# Altium project LimeSDR-QPCIe_1v2.PrjPcb (part 9 of 13)

## Sheet 24_Peripherals.SchDoc: Peripherals
size A3; Organization: Lime Microsystems; Address1: Surrey Tech Centre; Address2: Guildford GU2 7YG; Address3: Surrey; Address4: United Kingdom; Revision: v1.2; SheetNumber: 22; SheetTotal: 27
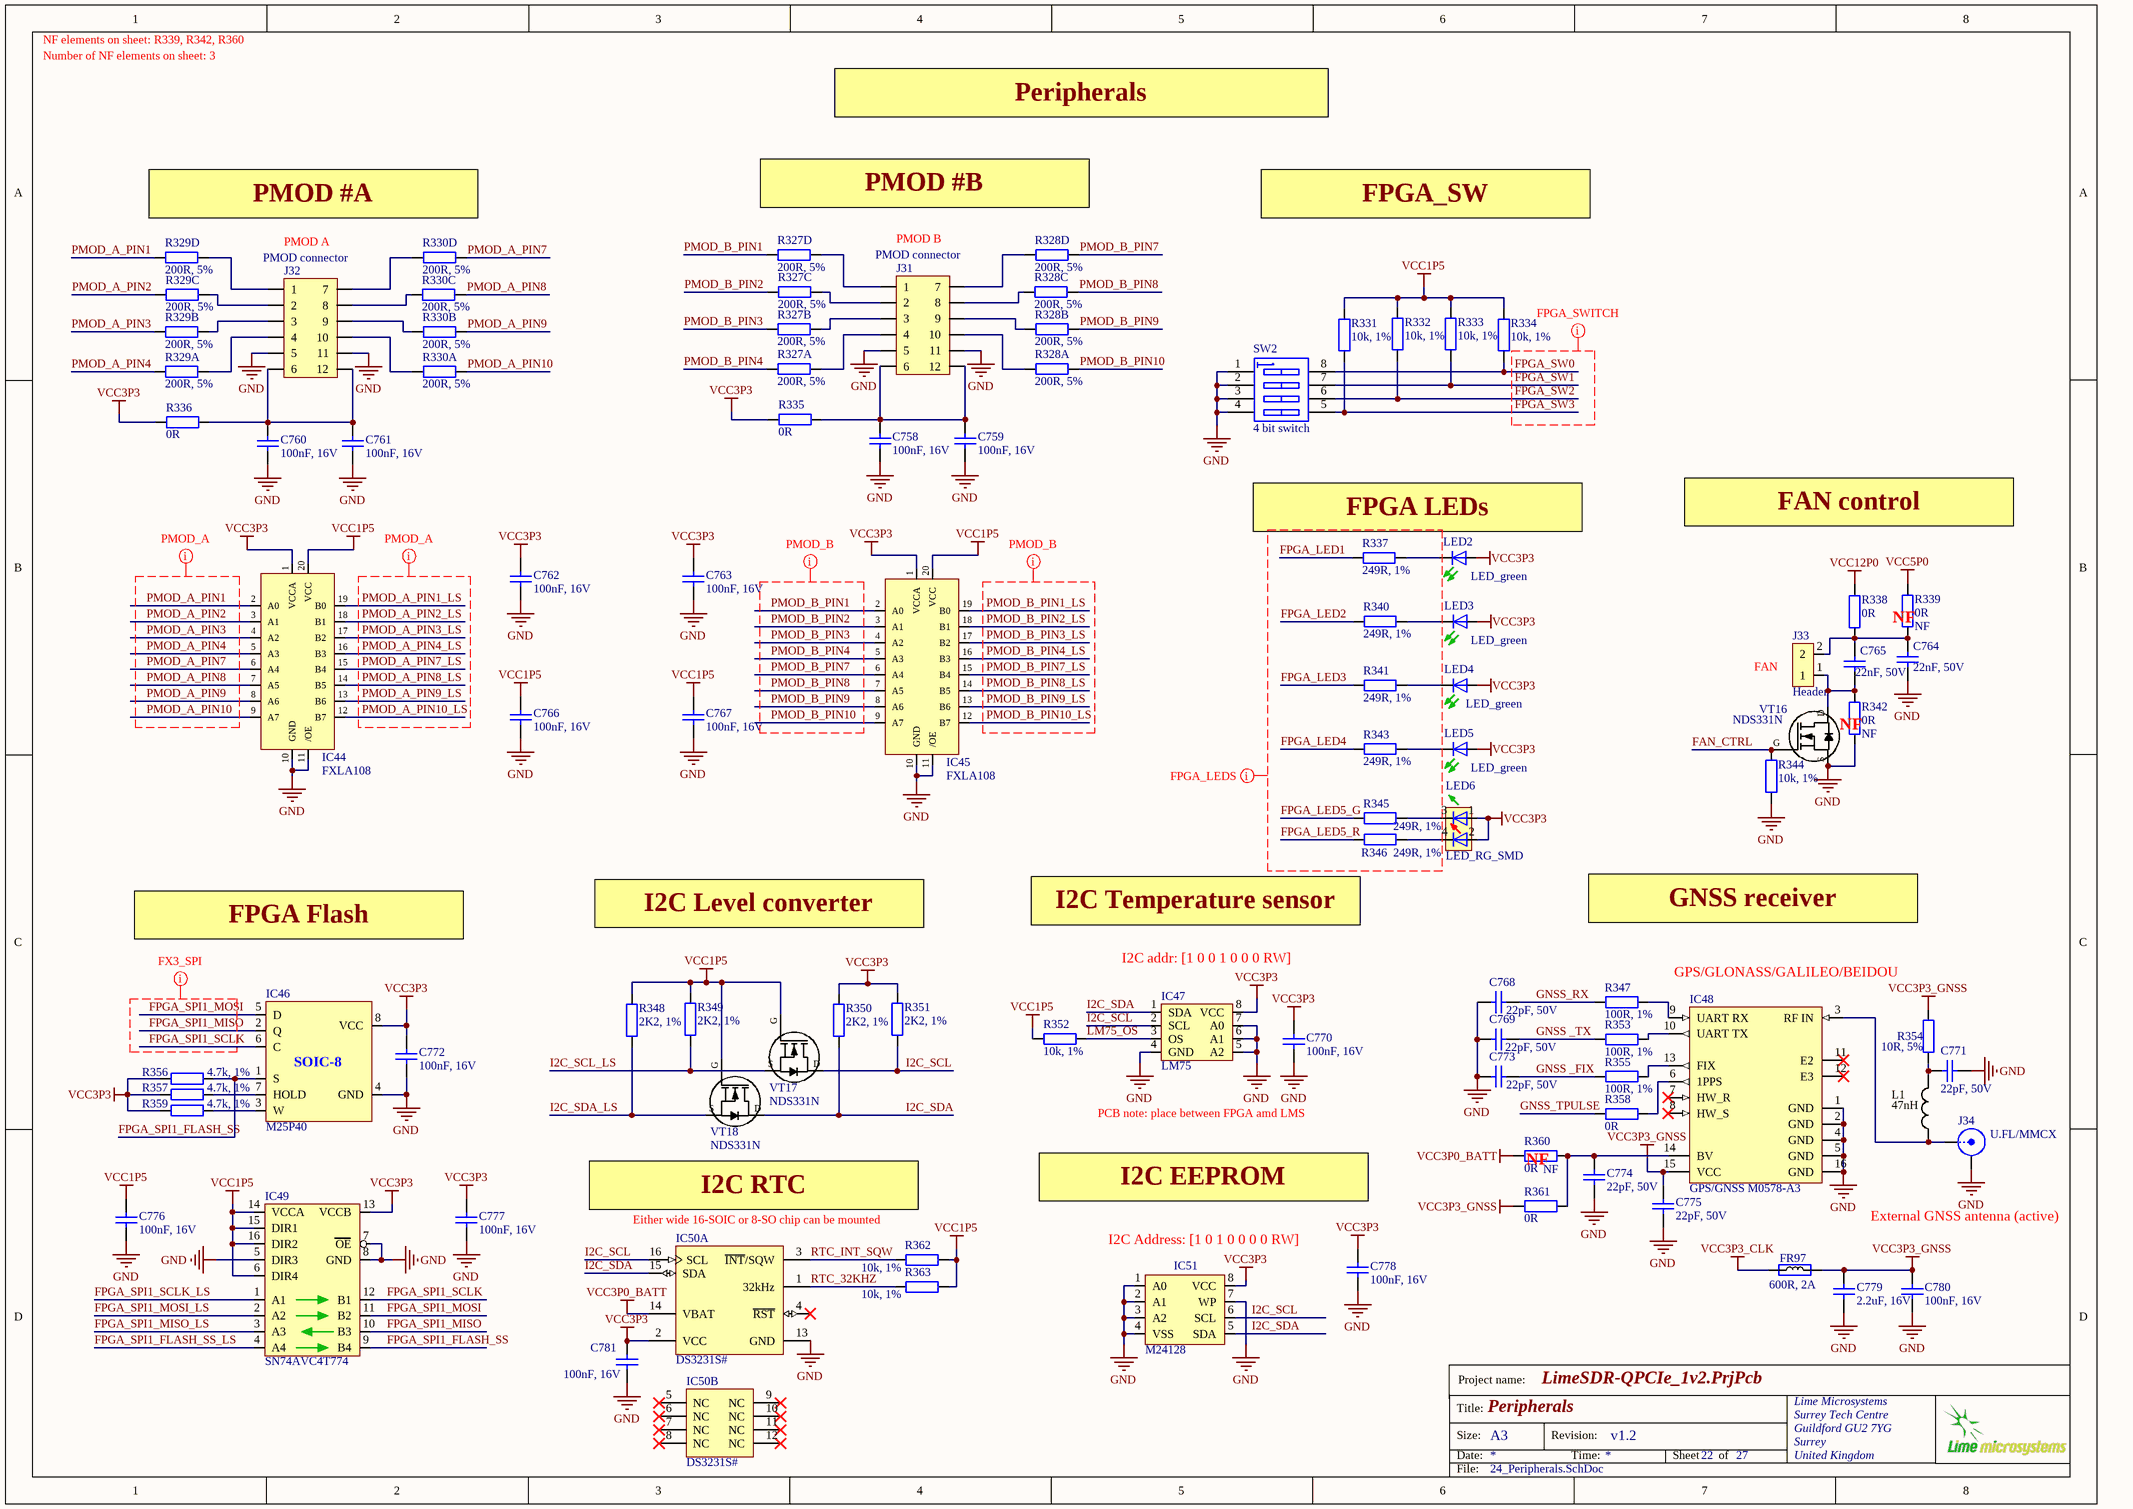
[diagram p23: 24_Peripherals.SchDoc]

### Parts
C758  100nF, 16V  [CAP0402]
C759  100nF, 16V  [CAP0402]
C760  100nF, 16V  [CAP0402]
C761  100nF, 16V  [CAP0402]
C762  100nF, 16V  [CAP0402]
C763  100nF, 16V  [CAP0402]
C764  22nF, 50V  [CAP0402]
C765  22nF, 50V  [CAP0402]
C766  100nF, 16V  [CAP0402]
C767  100nF, 16V  [CAP0402]
C768  22pF, 50V  [CAP0402]
C769  22pF, 50V  [CAP0402]
C770  100nF, 16V  [CAP0402]
C771  22pF, 50V  [CAP0402]
C772  100nF, 16V  [CAP0402]
C773  22pF, 50V  [CAP0402]
C774  22pF, 50V  [CAP0402]
C775  22pF, 50V  [CAP0402]
C776  100nF, 16V  [CAP0402]
C777  100nF, 16V  [CAP0402]
C778  100nF, 16V  [CAP0402]
C779  2.2uF, 16V  [CAP0402]
C780  100nF, 16V  [CAP0402]
C781  100nF, 16V  [CAP0402]
FR97  600R, 2A  [RES0805]
IC44  FXLA108  [FXLA108]
IC45  FXLA108  [FXLA108]
IC46  M25P40  [M25P40-VMN6TPB_SO8N]
IC47  LM75  [HWSON8_LM75]
IC48  GPS/GNSS M0578-A3  [M10578-A3]
IC49  SN74AVC4T774  [SN74AVC4T774]
IC50  DS3231S#  [DS3231S#_SOIC16_SOIC8]  (parts A,B of 2)
IC51  M24128  [24FC512]
J31  PMOD connector  [PMODconn_right_angle_TH]
J32  PMOD connector  [PMODconn_right_angle_TH]
J33  Header  [HDR_1x2]
J34  U.FL/MMCX  [MMCX_UFL_conn_u]
L1  47nH  [RES0402]
LED2  LED_green  [LED-0603-GREEN]
LED3  LED_green  [LED-0603-GREEN]
LED4  LED_green  [LED-0603-GREEN]
LED5  LED_green  [LED-0603-GREEN]
LED6  LED_RG_SMD  [LED-2x0603]
R327  200R, 5%  [ChipResistorArray]  (parts A,B,C,D of 4)
R328  200R, 5%  [ChipResistorArray]  (parts A,B,C,D of 4)
R329  200R, 5%  [ChipResistorArray]  (parts A,B,C,D of 4)
R330  200R, 5%  [ChipResistorArray]  (parts A,B,C,D of 4)
R331  10k, 1%  [RES0402]
R332  10k, 1%  [RES0402]
R333  10k, 1%  [RES0402]
R334  10k, 1%  [RES0402]
R335  0R  [RES0402]
R336  0R  [RES0402]
R337  249R, 1%  [RES0402]
R338  0R  [RES0402]
R339  0R  Assembly Info: NF  [RES0402]
R340  249R, 1%  [RES0402]
R341  249R, 1%  [RES0402]
R342  0R  Assembly Info: NF  [RES0402]
R343  249R, 1%  [RES0402]
R344  10k, 1%  [RES0402]
R345  249R, 1%  [RES0402]
R346  249R, 1%  [RES0402]
R347  100R, 1%  [RES0402]
R348  2K2, 1%  [RES0402]
R349  2K2, 1%  [RES0402]
R350  2K2, 1%  [RES0402]
R351  2K2, 1%  [RES0402]
R352  10k, 1%  [RES0402]
R353  100R, 1%  [RES0402]
R354  10R, 5%  [RES0402]
R355  100R, 1%  [RES0402]
R356  4.7k, 1%  [RES0402]
R357  4.7k, 1%  [RES0402]
R358  0R  [RES0402]
R359  4.7k, 1%  [RES0402]
R360  0R  Assembly Info: NF  [RES0402_v2]
R361  0R  [RES0402]
R362  10k, 1%  [RES0402]
R363  10k, 1%  [RES0402]
SW2  4 bit switch  [SW_4WAY_SMD_1P27]
VT16  NDS331N  [SOT23-3]
VT17  NDS331N  [SOT23-3]
VT18  NDS331N  [SOT23-3]

### Nets
GND: C758.2 C759.2 C760.2 C761.2 C762.2 C763.2 C764.2 C766.2 C767.2 C768.2 C769.2 C770.2 C771.1 C772.2 C773.2 C774.1 C775.1 C776.2 C777.2 C778.2 C779.1 C780.1 C781.2 IC44.10(GND) IC44.11(/OE) IC45.10(GND) IC45.11(/OE) IC46.4(GND) IC47.4(GND) IC47.5(A2) IC47.6(A1) IC47.7(A0) IC48.1(GND) IC48.2(GND) IC48.4(GND) IC48.5(GND) IC48.16(GND) IC49.5(DIR3) IC49.7(OE) IC49.8(GND) IC50.13(GND) IC51.1(A0) IC51.2(A1) IC51.3(A2) IC51.4(VSS) IC51.7(WP) J31.5 J31.11 J32.5 J32.11 J34.2(Y) R342.1 R344.2 SW2.1(A1) SW2.2(A2) SW2.3(A3) SW2.4(A4) VT16.S
VCC1P5: C766.1 C767.1 C776.1 IC44.20(VCC) IC45.20(VCC) IC49.6(DIR4) IC49.14(VCCA) IC49.15(DIR1) IC49.16(DIR2) R331.1 R332.1 R333.1 R334.1 R348.1 R349.1 R352.2 R362.2 R363.2 VT17.G VT18.G
VCC3P0_BATT: IC50.14(VBAT) R360.2
VCC3P3: C762.1 C763.1 C770.1 C772.1 C777.1 C778.1 C781.1 IC44.1(VCCA) IC45.1(VCCA) IC46.8(VCC) IC47.8(VCC) IC49.13(VCCB) IC50.2(VCC) IC51.8(VCC) LED2.A LED3.A LED4.A LED5.A LED6.1 LED6.2 R335.2 R336.2 R350.1 R351.1 R356.2 R357.2 R359.2
VCC3P3_CLK: FR97.1
VCC3P3_GNSS: C775.2 C779.2 C780.2 FR97.2 IC48.15(VCC) R354.1 R361.2
VCC5P0: R339.2
VCC12P0: R338.2
FAN_CTRL: R344.1 VT16.G
FPGA_LED1: R337.1
FPGA_LED2: R340.1
FPGA_LED3: R341.1
FPGA_LED4: R343.1
FPGA_LED5_G: R345.1
FPGA_LED5_R: R346.1
FPGA_SPI1_FLASH_SS: IC46.1(S) IC49.9(B4) R356.1
FPGA_SPI1_FLASH_SS_LS: IC49.4(A4)
FPGA_SPI1_MISO: IC46.2(Q) IC49.10(B3)
FPGA_SPI1_MISO_LS: IC49.3(A3)
FPGA_SPI1_MOSI: IC46.5(D) IC49.11(B2)
FPGA_SPI1_MOSI_LS: IC49.2(A2)
FPGA_SPI1_SCLK: IC46.6(C) IC49.12(B1)
FPGA_SPI1_SCLK_LS: IC49.1(A1)
FPGA_SW0: R334.2 SW2.8(B1)
FPGA_SW1: R333.2 SW2.7(B2)
FPGA_SW2: R332.2 SW2.6(B3)
FPGA_SW3: R331.2 SW2.5(B4)
GNSS _FIX: C773.1 R355.2
GNSS _TX: C769.1 R353.2
GNSS_RX: C768.1 R347.2
GNSS_TPULSE: R358.2
I2C_SCL: IC47.2(SCL) IC50.16(SCL) IC51.6(SCL) R351.2 VT17.D
I2C_SCL_LS: R349.2 VT17.S
I2C_SDA: IC47.1(SDA) IC50.15(SDA) IC51.5(SDA) R350.2 VT18.D
I2C_SDA_LS: R348.2 VT18.S
LM75_OS: IC47.3(OS) R352.1
PMOD_A_PIN1: IC44.2(A0) R329.7
PMOD_A_PIN1_LS: IC44.19(B0)
PMOD_A_PIN2: IC44.3(A1) R329.5
PMOD_A_PIN2_LS: IC44.18(B1)
PMOD_A_PIN3: IC44.4(A2) R329.3
PMOD_A_PIN3_LS: IC44.17(B2)
PMOD_A_PIN4: IC44.5(A3) R329.1
PMOD_A_PIN4_LS: IC44.16(B3)
PMOD_A_PIN7: IC44.6(A4) R330.7
PMOD_A_PIN7_LS: IC44.15(B4)
PMOD_A_PIN8: IC44.7(A5) R330.5
PMOD_A_PIN8_LS: IC44.14(B5)
PMOD_A_PIN9: IC44.8(A6) R330.3
PMOD_A_PIN9_LS: IC44.13(B6)
PMOD_A_PIN10: IC44.9(A7) R330.1
PMOD_A_PIN10_LS: IC44.12(B7)
PMOD_B_PIN1: IC45.2(A0) R327.7
PMOD_B_PIN1_LS: IC45.19(B0)
PMOD_B_PIN2: IC45.3(A1) R327.5
PMOD_B_PIN2_LS: IC45.18(B1)
PMOD_B_PIN3: IC45.4(A2) R327.3
PMOD_B_PIN3_LS: IC45.17(B2)
PMOD_B_PIN4: IC45.5(A3) R327.1
PMOD_B_PIN4_LS: IC45.16(B3)
PMOD_B_PIN7: IC45.6(A4) R328.7
PMOD_B_PIN7_LS: IC45.15(B4)
PMOD_B_PIN8: IC45.7(A5) R328.5
PMOD_B_PIN8_LS: IC45.14(B5)
PMOD_B_PIN9: IC45.8(A6) R328.3
PMOD_B_PIN9_LS: IC45.13(B6)
PMOD_B_PIN10: IC45.9(A7) R328.1
PMOD_B_PIN10_LS: IC45.12(B7)
RTC_32KHZ: IC50.1(32kHz) R363.1
RTC_INT_SQW: IC50.3(~{INT}/SQW) R362.1
NetC758_1: C758.1 C759.1 J31.6 J31.12 R335.1
NetC760_1: C760.1 C761.1 J32.6 J32.12 R336.1
NetC764_1: C764.1 C765.1 J33.2 R338.1 R339.1
NetC765_2: C765.2 J33.1 R342.2 VT16.D
NetC771_2: C771.2 L1.2 R354.2
NetC774_2: C774.2 IC48.14(BV) R360.1 R361.1
NetIC46_3: IC46.3(W) R359.1
NetIC46_7: IC46.7(HOLD) R357.1
NetIC48_3: IC48.3(RF_IN) J34.1(X) L1.1
NetIC48_6: IC48.6(1PPS) R358.1
NetIC48_9: IC48.9(UART_RX) R347.1
NetIC48_10: IC48.10(UART_TX) R353.1
NetIC48_13: IC48.13(FIX) R355.1
NetJ31_1: J31.1 R327.8
NetJ31_2: J31.2 R327.6
NetJ31_3: J31.3 R327.4
NetJ31_4: J31.4 R327.2
NetJ31_7: J31.7 R328.8
NetJ31_8: J31.8 R328.6
NetJ31_9: J31.9 R328.4
NetJ31_10: J31.10 R328.2
NetJ32_1: J32.1 R329.8
NetJ32_2: J32.2 R329.6
NetJ32_3: J32.3 R329.4
NetJ32_4: J32.4 R329.2
NetJ32_7: J32.7 R330.8
NetJ32_8: J32.8 R330.6
NetJ32_9: J32.9 R330.4
NetJ32_10: J32.10 R330.2
NetLED2_K: LED2.K(C) R337.2
NetLED3_K: LED3.K(C) R340.2
NetLED4_K: LED4.K(C) R341.2
NetLED5_K: LED5.K(C) R343.2
NetLED6_3: LED6.3 R345.2
NetLED6_4: LED6.4 R346.2

Not connected (* = marked no-connect by the designer): IC48 7(HW_R)* 8(HW_S)* 11(E2)* 12(E3)*; IC50 4(~{RST})* 5(NC)* 6(NC)* 7(NC)* 8(NC)* 9(NC)* 10(NC)* 11(NC)* 12(NC)*

### Layout directives
net class FX3_SPI: FPGA_SPI1_MISO, FPGA_SPI1_MOSI, FPGA_SPI1_SCLK
net class PMOD_A: PMOD_A_PIN1, PMOD_A_PIN1_LS, PMOD_A_PIN2, PMOD_A_PIN2_LS, PMOD_A_PIN3, PMOD_A_PIN3_LS, PMOD_A_PIN4, PMOD_A_PIN4_LS, PMOD_A_PIN7, PMOD_A_PIN7_LS, PMOD_A_PIN8, PMOD_A_PIN8_LS, PMOD_A_PIN9, PMOD_A_PIN9_LS, PMOD_A_PIN10, PMOD_A_PIN10_LS
net class PMOD_B: PMOD_B_PIN1, PMOD_B_PIN1_LS, PMOD_B_PIN2, PMOD_B_PIN2_LS, PMOD_B_PIN3, PMOD_B_PIN3_LS, PMOD_B_PIN4, PMOD_B_PIN4_LS, PMOD_B_PIN7, PMOD_B_PIN7_LS, PMOD_B_PIN8, PMOD_B_PIN8_LS, PMOD_B_PIN9, PMOD_B_PIN9_LS, PMOD_B_PIN10, PMOD_B_PIN10_LS
net class FPGA_SWITCH: FPGA_SW0, FPGA_SW1, FPGA_SW2, FPGA_SW3
net class FPGA_LEDS: FPGA_LED1, FPGA_LED2, FPGA_LED3, FPGA_LED4, FPGA_LED5_G, FPGA_LED5_R

### Notes on the sheet
- NF elements on sheet: R339, R342, R360
- Number of NF elements on sheet: 3
- Peripherals
- PMOD #A
- (near J32) PMOD A
- PMOD #B
- (near J31) PMOD B
- FPGA_SW
- FPGA LEDs
- FAN control
- (near R339) NF
- FAN
- NF
- I2C Level converter
- I2C Temperature sensor
- GNSS receiver
- FPGA Flash
- I2C addr: [1 0 0 1 0 0 0 RW]
- GPS/GLONASS/GALILEO/BEIDOU
- PCB note: place between FPGA amd LMS
- (near R360) NF
- I2C RTC
- Either wide 16-SOIC or 8-SO chip can be mounted
- I2C EEPROM
- I2C Address: [1 0 1 0 0 0 0 RW]
- External GNSS antenna (active)
- Project name:
- Title:
- Size:
- Date:
- A3
- Revision:
- Time:
- Sheet
- of
- File:
- (in symbol M25P40) SOIC-8

### Library data of the parts
C758-C761 C770 = Cap_0603: Manufacturer Part Number 1: GRM155R71C104KA88D; Part Description: 0.10µF ±10% 16V Ceramic Capacitor X7R 0402 (1005 Metric); Brand: Murata Electronics; Tolerance: 10 %; Type: General Purpose MLCC; Capacitance: 0.1 uF; Temperature Coefficient / Code: +/- 15 %; Case Height: 0.5 mm; Case Length: 1 mm; Dielectric: X7R; Supplier 1: Mouser; Supplier Part Number 1: 81-GRM155R71C104KA88; Case Code - in: 0402; Manufacturer: Murata Electronics; Category: Multilayer Ceramic Capacitors MLCC - SMD/SMT; Voltage Rating DC: 16 V; Value: 100nF, 16V; Manufacturer Part Number: GRM155R71C104KA88D; Case Code - mm: 1005; Case Width: 0.5 mm; Maximum Operating Temperature: + 125 C; Minimum Operating Temperature: - 55 C; Minimum Order Quantity: 1; Operating Temperature Range: - 55 C to + 125 C; Package / Case: 0402 (1005 metric); Packaging: Reel; Product: General Type MLCCs; Product Category: Low & Medium Capacitance SMD Ceramic Chip Capacitors; Reeling: True; RoHS - Mouser: Y; RoHS: RoHS Compliant; Series: GRM; Standard Pack Qty: 10000; Termination Style: SMD/SMT
C762 C763 C766 C767 C772 C776 C777 = Cap_0603: Part Description: 0.10µF ±10% 16V Ceramic Capacitor X7R 0402 (1005 Metric); Manufacturer Part Number 1: GRM155R71C104KA88D; Brand: Murata Electronics; Tolerance: 10 %; Type: General Purpose MLCC; Capacitance: 0.1 uF; Temperature Coefficient / Code: +/- 15 %; Case Height: 0.5 mm; Case Length: 1 mm; Dielectric: X7R; Supplier 1: Mouser; Supplier Part Number 1: 81-GRM155R71C104KA88; Case Code - in: 0402; Manufacturer: Murata Electronics; Category: Multilayer Ceramic Capacitors MLCC - SMD/SMT; Voltage Rating DC: 16 V; Value: 100nF, 16V; Case Code - mm: 1005; Case Width: 0.5 mm; Manufacturer Part Number: GRM155R71C104KA88D; Maximum Operating Temperature: + 125 C; Minimum Operating Temperature: - 55 C; Minimum Order Quantity: 1; Operating Temperature Range: - 55 C to + 125 C; Package / Case: 0402 (1005 metric); Packaging: Reel; Product: General Type MLCCs; Product Category: Low & Medium Capacitance SMD Ceramic Chip Capacitors; Reeling: True; RoHS - Mouser: Y; RoHS: RoHS Compliant; Series: GRM; Standard Pack Qty: 10000; Termination Style: SMD/SMT
C764 C765 = Cap_0402: Manufacturer: Kemet; Manufacturer Part Number 1: C0402C223K5RACTU; Part Description: 0.022µF ±10% 50V Ceramic Capacitor X7R 0402 (1005 Metric); Temperature Coefficient: X7R; Tolerance: ±10%; Capacitance: 0.022µF; Value: 22nF, 50V; Supplier 1: Digi-Key; Supplier Part Number 1: 399-7780-1-ND; Ratings: -; Packaging: Cut Tape (CT); Category: Capacitors; Size / Dimension: 0.039" L x 0.020" W (1.00mm x 0.50mm); RoHS: RoHS Compliant; Operating Temperature: -55°C ~ 125°C; Mounting Type: Surface Mount, MLCC; Applications: General Purpose; Voltage - Rated: 50V; Thickness (Max): 0.022" (0.55mm); Features: -; Height - Seated (Max): -; Lead Style: -; Package / Case: 0402 (1005 Metric); Lead Spacing: -
C768 C769 C771 C773-C775 = Cap_0402: Manufacturer: Yageo; Manufacturer Part Number 1: CC0402JRNPO9BN220; Part Description: 22pF ±5% 50V Ceramic Capacitor C0G, NP0 0402 (1005 Metric); Tolerance: ±5%; Temperature Coefficient: C0G, NP0; Value: 22pF, 50V; Supplier 1: Digi-Key; Supplier Part Number 1: 311-1018-2-ND; Category: Capacitors; Voltage - Rated: 50V; Packaging: Tape & Reel (TR); RoHS: RoHS Compliant; Capacitance: 22pF; Operating Temperature: -55°C ~ 125°C; Mounting Type: Surface Mount, MLCC; Height - Seated (Max): -; Size / Dimension: 0.039" L x 0.020" W (1.00mm x 0.50mm); Ratings: -; Applications: General Purpose; Thickness (Max): 0.022" (0.55mm); Lead Spacing: -; Lead Style: -; Features: -; Package / Case: 0402 (1005 Metric)
C778 = Cap_0603: Manufacturer Part Number 1: GRM155R71C104KA88D; Part Description: 0.10µF ±10% 16V Ceramic Capacitor X7R 0402 (1005 Metric); Brand: Murata Electronics; Tolerance: 10 %; Type: General Purpose MLCC; Capacitance: 0.1 uF; Temperature Coefficient / Code: +/- 15 %; Supplier 1: Mouser; Supplier Part Number 1: 81-GRM155R71C104KA88; Case Code - in: 0402; Manufacturer: Murata Electronics; Category: Multilayer Ceramic Capacitors MLCC - SMD/SMT; Voltage Rating DC: 16 V; Value: 100nF, 16V; Manufacturer Part Number: GRM155R71C104KA88D
C779 = Cap_0402: CAP CER 2.2UF 16V 10% X5R 0402; Manufacturer Part Number 1: C1005X5R1C225K050BC; Manufacturer: TDK Corporation; Part Description: 2.2µF ±10% 16V Ceramic Capacitor X5R 0402 (1005 Metric); Capacitance: 2.2µF; Tolerance: ±20%; Capacitor Case Style: 0402 [1005 Metric]; Value: 2.2uF, 16V; Supplier 1: Digi-Key; Supplier Part Number 1: 445-9085-6-ND; Category: Capacitors; Voltage - Rated: 16V; Thickness (Max): 0.022" (0.55mm); Applications: General Purpose; Package / Case: 0402 (1005 Metric); Size / Dimension: 0.039" L x 0.020" W (1.00mm x 0.50mm); Features: -; Temperature Coefficient: X5R; Mounting Type: Surface Mount, MLCC; Ratings: -; Lead Style: -; Operating Temperature: -55°C ~ 85°C; Lead Spacing: -; RoHS: RoHS Compliant; Height - Seated (Max): -; Packaging: Tape & Reel (TR); Operating Temperature Range: -55°C to +85
C780 C781 = Cap_0402: Manufacturer: Murata Electronics; Manufacturer Part Number: GRM155R71C104KA88D; Part Description: 0.10µF ±10% 16V Ceramic Capacitor X7R 0402 (1005 Metric); Tolerance: 10 %; Type: General Purpose MLCC; Capacitance: 0.1 uF; Case Length: 1 mm; Dielectric: X7R; Case Height: 0.5 mm; Temperature Coefficient / Code: +/- 15 %; Value: 100nF, 16V; Supplier 1: Mouser; Supplier Part Number 1: 81-GRM155R71C104KA88; Case Code - in: 0402; RoHS: RoHS Compliant; Operating Temperature Range: - 55 C to + 125 C; Series: GRM; Termination Style: SMD/SMT; Package / Case: 0402 (1005 metric); Voltage Rating DC: 16 V; Maximum Operating Temperature: + 125 C; Case Code - mm: 1005; Minimum Operating Temperature: - 55 C; Product Category: Low & Medium Capacitance SMD Ceramic Chip Capacitors; Packaging: Reel; Product: General Type MLCCs; Category: Multilayer Ceramic Capacitors MLCC - SMD/SMT; Brand: Murata Electronics; Case Width: 0.5 mm; RoHS - Mouser: Y; Standard Pack Qty: 10000; Minimum Order Quantity: 1; Reeling: True; Manufacturer Part Number 1: GRM155R71C104KA88D
FR97 = Ferrite: Manufacturer Part Number 1: MPZ2012S601A; Manufacturer: TDK; Part Description: FERRITE BEAD 600 OHM 0805 1LN; Filter Type: Differential Mode - Single; Impedance @ Frequency: 600 Ohm @ 100MHz; DC Resistance (DCR): 100 mOhm Max; DC Current Rating: 2; DC Resistance Max: 0.1; Ferrite Case Style: 0805 [2012 Metric]; Ferrite Mounting: SMD; Impedance @ 100MHz: 600; Impedance Tolerance: ± 25%; Supplier 1: Farnell; Supplier Part Number 1: 1669753RL; Mounting Type: Surface Mount; RoHS: RoHS Compliant; Height (Max): 0.041" (1.05mm); Packaging: Tape & Reel (TR); Category: Filters; Current Rating: 2A; Package / Case: 0805 (2012 Metric); Size / Dimension: 0.079" L x 0.049" W (2.00mm x 1.25mm); Value: 600R, 2A; Core Material: Ferrite; Supplier: Farnell
IC44 IC45 = FXLA108: Manufacturer: Fairchild Semiconductor; Manufacturer Part Number 1: FXLA108BQX; Part Description: Voltage Level Translator Bidirectional 1 Circuit 8 Channel 140Mbps 20-DQFN (2.5x4.5); Logic Function: Translator, Bidirectional, Unidirectional, 3-State; Data Rate: 140Mbps; Voltage - Supply: 1.1 V ~ 3.6 V; Propagation Delay (Max): 4ns; Supplier 1: Digi-Key; Supplier Device Package: 20-DQFN; Category: Integrated Circuits (ICs); Supplier Part Number 1: FXLA108BQXCT-ND
IC46 = M25P40: Manufacturer: Micron Technology Inc; Manufacturer Part Number 1: M25P40-VMN6TPB TR; Part Description: IC FLASH 4MBIT 75MHZ 8SO; Memory Size: 4M (512K x 8); Voltage - Supply: 2.3 V ~ 3.6 V; Supplier 1: Digi-Key; Supplier Device Package: 8-SO; Supplier: Digi-Key; Supplier Part Number 1: M25P40-VMN6TPBTR-ND
IC47 = LM75: Manufacturer: NXP Semiconductors; Manufacturer Part Number: LM75BTP,147; Part Description: Temperature Sensor Digital, Local -55°C ~ 125°C 11 b 8-HWSON (2x3); Sensing Temperature - Local: -55°C ~ 125°C; Output Type: I²C; Accuracy - Highest (Lowest): ±2°C (±3°C); Voltage - Supply: 2.8 V ~ 5.5 V; Test Condition: -25°C ~ 100°C (-55°C ~ 125°C); Sensor Type: Digital, Local; Resolution: 10 b; Supplier 1: Digi-Key; Operating Temperature: -55°C ~ 125°C; Features: Output Switch, Programmable Limit, Shutdown Mode; Supplier Device Package: 8-HWSON (2x3); Sensing Temperature - Remote: -; Category: Sensors, Transducers; Packaging: Tape & Reel (TR); RoHS: RoHS Compliant; Package / Case: 8-WFDFN Exposed Pad; Supplier Part Number 1: 568-9815-2-ND
IC48 = M10578-A3_GPS_GNSS: Manufacturer: Antenova; Part Description: RADIONOVA RF Receiver GPS 1.575GHz -165dBm Module; Frequency: 1.575GHz; Sensitivity: -165dBm; Modulation or Protocol: GPS; Current - Receiving: 28mA; Data Interface: UART; Voltage - Supply: 3.3V; Supplier 1: Digi-Key; Manufacturer Part Number 1: M10578-A3; RoHS: RoHS Compliant; Category: RF/IF and RFID; Stock 1: 0; Pricing 1: 1=17.75, 10=16.061, 25=14.7928, 100=13.5248, 250=12.67952, 500=11.8342 (USD); Packaging: Cut Tape (CT); Part Status: Active; Data Rate (Max): -; Applications: General Purpose; Memory Size: -; Antenna Connector: -; Features: -; Operating Temperature: -40°C ~ 85°C; Package / Case: Module; Supplier Device Package: Module; ComponentLink1URL: http://www.antenova-m2m.com/wp-content/uploads/2015/12/GPS_Radionova_M10578-A3-PS-1.0.pdf; ComponentLink1Description: http://www.antenova-m2m.com/wp-content/uploads/2015/12/GPS_Radionova_M10578-A3-PS-1.0.pdf; Supplier Part Number 1: 627-1074-1-ND
IC49 = SN74AVC4T774: Manufacturer: Texas Instruments; Manufacturer Part Number 1: SN74AVC4T774RSVR; Part Description: Voltage Level Translator Bidirectional 1 Circuit 4 Channel 380Mbps 16-UQFN (2.6x1.8); Logic Function: Translator, Bidirectional, 3-State; Differential - Input:Output: No/No; Propagation Delay (Max): 2.4ns; Number of Bits: 4; Number of Outputs/Channel: 1; Input Type: Logic; Voltage - Supply: 1.2 V ~ 3.6 V; Data Rate: 380Mbps; Supplier 1: Digi-Key; Supplier Device Package: 16-UQFN (2.6x1.8); Packaging: Digi-Reel®; Category: Integrated Circuits (ICs); Mounting Type: Surface Mount; RoHS: RoHS Compliant; Number of Channels: 4; Output Type: Logic; Package / Case: 16-UFQFN; Operating Temperature: -40°C ~ 85°C; Supplier Part Number 1: 296-24741-6-ND
IC50 = DS3231S#: Extremely Accurate I2C-Integrated Real-Time Clock/TCXO/Crystal, 16-Pin SO, 0 to 70 degC, RoHS Qualified; Manufacturer: MAXIM INTEGRATED PRODUCTS; Part Description: Real Time Clock (RTC) IC Clock/Calendar I²C, 2-Wire Serial 16-SOIC (0.295", 7.50mm Width); Date Format: YY-MM-DD; Clock Format: HH; Clock IC Type: RTC; Supply Voltage Min: 2.3; Supply Voltage Max: 5.5; Clock IC Case Style: WSOIC; No. of Pins: 16; IC Interface Type: I2; Supply Voltage Range: 2.3V to 5.5V<!--FANDB--><div class="features-and-benefits-container"><div class="features-and-benefits-description"><span class="features-benefits-value">The DS3231S# is an extremely accurate I²C Real-time Clock (RTC) with an integrated temperature compensated crystal oscillator (TCXO) and crystal. The device incorporates a battery input and maintains accurate timekeeping when main power to the device is interrupted. The integration of the crystal resonator enhances the long-term accuracy of the device as well as reduces the piece-part count in a manufacturing line. The RTC maintains seconds, minutes, hours, day, date, month and year information. The date at the end of the month is automatically adjusted for months with fewer than 31 days, including corrections for leap year. The clock operates in either the 24-hour or 12-hour format with an AM/PM indicator. Two programmable time-of-day alarms and a programmable square-wave output are provided. Address and data are transferred serially through an I²C bidirectional bus.</span></div><div class="features-and-benefits-list"><ul class="features-and-benefits-list-list"><li class="features-and-benefits-list-item">Highly accurate RTC completely manages all timekeeping functions</li><li class="features-and-benefits-list-item">±3; Supplier 1: Farnell; Manufacturer Part Number 1: DS3231S#; RoHS: YES; Pricing 1: 1=6.3, 10=5.75, 25=5.04, 50=4.69, 100=4.33, 250=4.09, 1000=3.84 (GBP); Operating Temperature Min: 0; Operating Temperature Max: 70; Packaging: Each; Product Range: -; Automotive Qualification Standard: -; MSL: MSL 1 - Unlimited; Operating Temperature Range: 0°C to +70; ComponentLink1URL: http://www.farnell.com/datasheets/1904442.pdf; ComponentLink1Description: http://www.farnell.com/datasheets/1904442.pdf; Supplier Part Number 1: 2519295
IC51 = 24FC64F: Part Description: IC EEPROM 128KBIT 1MHZ 8TSSOP; Manufacturer: STMicroelectronics; Manufacturer Part Number 1: M24128-DRDW8TP/K; Format - Memory: EEPROMs - Serial; Memory Type: EEPROM; Memory Size: 128K (16K x 8); Speed: 1MHz; Interface: I²C, 2-Wire Serial; Voltage - Supply: 1.8 V ~ 5.5 V; Supplier 1: Digi-Key; Supplier Part Number 1: 497-15336-1-ND; RoHS: RoHS Compliant; Category: Integrated Circuits (ICs); Stock 1: 1677; Pricing 1: 1=0.47, 10=0.464, 100=0.3805, 500=0.36996, 1000=0.36005 (USD); Packaging: Cut Tape (CT); Part Status: Active; Operating Temperature: -40°C ~ 105°C (TA); Package / Case: 8-TSSOP (0.173", 4.40mm Width); Supplier Device Package: 8-TSSOP; ComponentLink1URL: http://www.st.com/content/ccc/resource/technical/document/datasheet/5c/f3/4b/70/8e/63/48/95/DM00149696.pdf/files/DM00149696.pdf/jcr:content/translations/en.DM00149696.pdf; ComponentLink1Description: http://www.st.com/content/ccc/resource/technical/document/datasheet/5c/f3/4b/70/8e/63/48/95/DM00149696.pdf/files/DM00149696.pdf/jcr:content/translations/en.DM00149696.pdf
J31 J32 = PMOD_connector: Header, 4-Pin, Dual row; Manufacturer: Sullins Connector Solutions; Part Description: 12 Position Header Connector 0.100" (2.54mm) Through Hole, Right Angle Gold; Manufacturer Part Number 1: PPPC062LJBN-RC; Row Spacing: 0.100" (2.54mm); Number of Positions Loaded: All; Number of Positions: 12; Supplier 1: Digi-Key; Mounting Type: Through Hole, Right Angle; Contact Finish: Gold; Features: -; Category: Connectors, Interconnects; Packaging: Bulk; RoHS: RoHS Compliant; Number of Rows: 2; Contact Finish Thickness: Flash; Pitch: 0.100" (2.54mm); Termination: Solder; Contact Type: Female Socket; Color: Black; Connector Type: Header; Fastening Type: -; Supplier Part Number 1: S5559-ND
J33 = Jumper: Manufacturer Part Number 1: 961102-6404-AR; Part Description: 2 Positions Header, Unshrouded Connector 0.100" (2.54mm) Through Hole Gold; Manufacturer: 3M; Connector Type: Header, Unshrouded; Supplier 1: Digi-Key; Supplier Part Number 1: 3M9447-ND; Contact Type: Male Pin; Color: Black; Mounting Type: Through Hole; Category: Connectors, Interconnects; Contact Finish: Gold
J34 = RF_IF_connector: CONN UMC RCPT STR 50 OHM SMD; Manufacturer: Molex, LLC; Manufacturer Part Number 1: 0734120110; Part Description: Ultra Miniature Coaxial Connector Receptacle, Male Pin 50 Ohm Surface Mount Solder; Body Finish: Nickel; Body Material: Phosphor Bronze; Center Contact Material: Brass; Center Contact Plating: Gold; Connector Style: Ultra Miniature Coaxial; Connector Type: Jack, Male Pin; Contact Termination: Solder; Dielectric Material: Liquid Crystal Polymer (LCP); Frequency - Max: 6GHz; Impedance: 50 Ohm; Voltage Rating: 60V; Cable Group: -; Category: Connectors, Interconnects; Fastening Type: Snap-On; Features: -; Housing Color: Silver; Ingress Protection: -; Mounting Type: Surface Mount; Operating Temperature: -40°C ~ 90°C; Packaging: Cut Tape (CT); RoHS: RoHS Compliant; Shield Termination: Solder; Supplier 1: Digi-Key; Supplier Part Number 1: WM5587CT-ND
L1 = Inductor_0603: Manufacturer: COILCRAFT; Manufacturer Part Number: 0402HP-47NXJLU; Part Description: COILCRAFT  0402HP-47NXJLU  Surface Mount High Frequency Inductor, 0402HP Series, 47 nH, 420 mA, 0402 [1005 Metric], Wirewound; SVHC: No SVHC (15-Jun-2015); Inductance Tolerance: ± 5%; High Frequency Inductor Case: 0402 [1005 Metric]; Inductor Case Style: 0402 [1005 Metric]<!--FANDB--><div class="features-and-benefits-container"></div>; Inductance: 47; DC Resistance Max: 0.58; Self Resonant Frequency Min: 2.4; Product Range: 0402; DC Current Rating: 420; Inductor Construction: Wirewound; Supplier 1: Farnell; Supplier Part Number 1: 2285856; Packaging: Cut Tape; RoHS: Y-EX; value: 47nH; Manufacturer Part Number 1: 0402HP-47NXJLU
LED2-LED5 = LED_green: Manufacturer Part Number 1: HSMG-C190; Manufacturer: Avago Technologies US Inc.; Part Description: Green 572nm LED Indication - Discrete 2.2V 0603 (1608 Metric); Manufacturer: Broadcom Limited; Color: Green; Wavelength - Peak: 570nm; Viewing Angle: 170°; Lens Type: Diffused; Lens Style/Size: Rectangle with Flat Top, 1mm x 0.8mm; Voltage - Forward (Vf) (Typ): 2.2V; Millicandela Rating: 15mcd; Current - Test: 20mA; Wavelength - Dominant: 572nm; Supplier 1: Digi-Key; Supplier Part Number 1: 516-1425-2-ND; Height: 0.80mm; Size / Dimension: 1.60mm L x 0.80mm W; Mounting Type: Surface Mount; Category: Optoelectronics; RoHS: RoHS Compliant; Luminous Flux @ Current - Test: -; Package / Case: 0603 (1608 Metric); Packaging: Tape & Reel (TR)
LED6 = LED_green_red_SMD: Manufacturer Part Number 1: HSMF-C165; Manufacturer: Avago Technologies US Inc.; Part Description: LED GREEN/RED DIFFUSED 0603 SMD; Millicandela Rating: 15mcd Green, 10mcd Red; Lens Transparency: Diffused; Lens Color: White; Lens Style/Size: Rectangle with Flat Top, 1.60mm x 0.80mm; Wavelength - Peak: 570nm Green, 636nm Red; Wavelength - Dominant: 572nm Green, 621nm Red; Viewing Angle: 120°; Voltage - Forward (Vf) (Typ): 2.2V Green, 1.95V Red; Current - Test: 20mA; Color: Green, Red; Supplier 1: Digi-Key; Height (Max): 0.50mm; Packaging: Cut Tape (CT); Category: Optoelectronics; Mounting Type: Surface Mount; Package / Case: 0603 (1608 Metric); Size / Dimension: 1.60mm L x 0.80mm W; Supplier Device Package: *; RoHS: RoHS Compliant; Supplier Part Number 1: 516-1419-1-ND
R327-R330 = ResArray_0802: Manufacturer: Vishay Dale; Manufacturer Part Number 1: CRA04S083200RJTD; Part Description: RES ARRAY 4 RES 200 OHM 0804; Circuit Type: Isolated; Resistance (Ohms): 200; Number of Resistors: 4; Power Per Element: 62.5mW; Temperature Coefficient: ±200ppm/°C; Supplier 1: Digi-Key; Supplier Part Number 1: CRA4S8200DKR-ND; Packaging: Digi-Reel®; RoHS: RoHS Compliant; Category: Resistors; Tolerance: ±5%; Number of Pins: 8; Operating Temperature: -55°C ~ 155°C; Applications: -; Mounting Type: Surface Mount; Package / Case: 0804, Convex, Long Side Terminals; Supplier Device Package: -; Size / Dimension: 0.079" L x 0.039" W (2.00mm x 1.00mm); Height: 0.022" (0.55mm)
R331-R334 R344 R352 R362 R363 = Res_0402: Manufacturer: Yageo; Manufacturer Part Number 1: RC0402FR-0710KL; Part Description: RES SMD 10K OHM 1% 1/16W 0402; Temperature Coefficient: ±100ppm/°C; Power (Watts): 0.063W, 1/16W; Value: 10k, 1%; Supplier 1: Digi-Key; Supplier Part Number 1: 311-10.0KLRTR-ND; Resistance (Ohms): 10k; Packaging: Tape & Reel (TR); RoHS: RoHS Compliant; Package / Case: 0402 (1005 Metric); Tolerance: ±1%; Operating Temperature: -55°C ~ 155°C; Size / Dimension: 0.039" L x 0.020" W (1.00mm x 0.50mm); Number of Terminations: 2; Category: Resistors; Height: 0.016" (0.40mm); Supplier Device Package: 0402; Features: Moisture Resistant; Composition: Thick Film
R335 R336 R338 R339 R342 R358 R360 R361 = Res_0402: Manufacturer Part Number 1: RC0402JR-070RL; Manufacturer: Yageo; Part Description: RES SMD 0.0OHM JUMPER 1/16W 0402; Resistance (Ohms): 0.0; Tolerance: Jumper; Power (Watts): 0.063W, 1/16W; Value: 0R; Supplier 1: Digi-Key; Supplier Part Number 1: 311-0.0JRTR-ND; Category: Resistors; Temperature Coefficient: -; Features: Moisture Resistant; Supplier Device Package: 0402; Height: 0.016" (0.40mm); Package / Case: 0402 (1005 Metric); Operating Temperature: -55°C ~ 155°C; Size / Dimension: 0.039" L x 0.020" W (1.00mm x 0.50mm); Composition: Thick Film; Packaging: Tape & Reel (TR); Number of Terminations: 2; RoHS: RoHS Compliant
R337 R340 R341 R343 R345 R346 = Res_0402: Manufacturer Part Number 1: RMCF0402FT249R; Manufacturer: Stackpole Electronics Inc; Part Description: RES SMD 249 OHM 1% 1/16W 0402; Resistance (Ohms): 249; Power (Watts): 0.063W, 1/16W; Temperature Coefficient: ±100ppm/°C; Value: 249R, 1%; Supplier 1: Digi-Key; Supplier Part Number 1: RMCF0402FT249RCT-ND; Package / Case: 0402 (1005 Metric); Features: -; Size / Dimension: 0.039" L x 0.020" W (1.00mm x 0.50mm); Category: Resistors; Operating Temperature: -55°C ~ 155°C; Packaging: Cut Tape (CT); Tolerance: ±1%; Supplier Device Package: 0402; RoHS: RoHS Compliant; Composition: Thick Film; Number of Terminations: 2; Height: 0.016" (0.40mm)
R347 R353 R355 = Res_0402: Manufacturer Part Number 1: RMCF0402FT100R; Part Description: RES SMD 100 OHM 1% 1/16W 0402; Manufacturer: Stackpole Electronics Inc.; Temperature Coefficient: ±100ppm/°C; Supplier 1: Digi-Key; Supplier Part Number 1: RMCF0402FT100RDKR-ND; Package / Case: 0402 (1005 Metric); Composition: Thick Film; Category: Resistors; Tolerance: ±1%; Value: 100R, 1%
R348-R351 = Res_0402: Part Description: RES SMD 2.2K OHM 1% 1/16W 0402; Manufacturer Part Number 1: RMCF0402FT2K20; Resistance (Ohms): 2.2k; Temperature Coefficient: ±100ppm/°C; Supplier 1: Digi-Key; Supplier Part Number 1: RMCF0402FT2K20CT-ND; Height: 0.016" (0.40mm); Tolerance: ±1%; Composition: Thick Film; Package / Case: 0402 (1005 Metric); Category: Resistors; Value: 2K2, 1%
R354 = Res_0402: Manufacturer Part Number 1: RC0402JR-0710RL; Manufacturer: Yageo; Part Description: RES SMD 10 OHM 5% 1/16W 0402; Power (Watts): 0.063W, 1/16W; Resistance (Ohms): 10; Temperature Coefficient: ±200ppm/°C; Value: 10R, 5%; Supplier 1: Digi-Key; Supplier Part Number 1: 311-10JRTR-ND; Number of Terminations: 2; Height: 0.016" (0.40mm); RoHS: RoHS Compliant; Composition: Thick Film; Packaging: Tape & Reel (TR); Category: Resistors; Supplier Device Package: 0402; Features: Moisture Resistant; Tolerance: ±5%; Operating Temperature: -55°C ~ 155°C; Size / Dimension: 0.039" L x 0.020" W (1.00mm x 0.50mm); Package / Case: 0402 (1005 Metric)
R356 R357 R359 = Res_0402: Manufacturer: Yageo; Part Description: RES SMD 4.7K OHM 1% 1/16W 0402; Manufacturer Part Number1: RC0402FR-074K7L; Temperature Coefficient: ±100ppm/°C; Power (Watts): 0.063W, 1/16W; Number of Terminations: 2; Category: Resistors; Supplier 1: Digi-Key; Height: 0.016" (0.40mm); Features: Moisture Resistant; Size / Dimension: 0.039" L x 0.020" W (1.00mm x 0.50mm); Supplier Device Package: 0402; RoHS: RoHS Compliant; Composition: Thick Film; Package / Case: 0402 (1005 Metric); Resistance (Ohms): 4.7k; Operating Temperature: -55°C ~ 155°C; Tolerance: ±1%; Supplier Part Number 1: 311-4.7KLRCT-ND; Packaging: Cut Tape (CT); Value: 4.7k, 1%
SW2 = SW_SM_4bit: Manufacturer Part Number 1: A6H-4101; Manufacturer: Omron Electronics Inc-EMC Div; Part Description: Dip Switch SPST 4 Position Surface Mount Slide (Standard) Actuator 25mA 24VDC; Pitch: 0.050" (1.27mm), Half; Mechanical Life: 1,000 Cycles; Washable: No; Current Rating: 25mA; Number of Positions: 4; Voltage Rating: 24VDC; Actuator Level: Flush, Recessed; Circuit: SPST; Actuator Type: Slide (Standard); Supplier 1: Digi-Key; Height Above Board: 0.061" (1.55mm); RoHS: RoHS Compliant; Termination Style: Gull Wing; Electrical Life: 1,000 Cycles; Length: 0.248" (6.31mm); Category: Switches; Operating Temperature: -20°C ~ 70°C; Body Material: -; Contact Material: -; Features: -; Mounting Type: Surface Mount; Contact Finish: -; Packaging: Tube; Supplier Part Number 1: SW1080-ND
VT16-VT18 = NDS331N: Part Description: MOSFET N-CH 20V 1.3A SSOT3; Manufacturer: Fairchild Semiconductor; Gate Charge (Qg) @ Vgs: 5nC @ 4.5V; Power - Max: 460mW; Current - Continuous Drain (Id) @ 25°C: 1.3A (Ta); Input Capacitance (Ciss) @ Vds: 162pF @ 10V; FET Type: MOSFET N-Channel, Metal Oxide; Drain to Source Voltage (Vdss): 20V; FET Feature: Logic Level Gate; Supplier Device Package: 3-SSOT; Category: Discrete Semiconductor Products; Mounting Type: Surface Mount; Package / Case: TO-236-3, SC-59, SOT-23-3; Supplier 1: Digi-Key; Supplier Part Number 1: NDS331NCT-ND; Manufacturer Part Number 1: NDS331N
  VT16 VT18: Manufacturer Part Number: NDS331N